# EAGLE design mic4606_logic (EAGLE 6.4)
Logic board for the Brushed Controller (v2a)

## Sheet 1 of 5
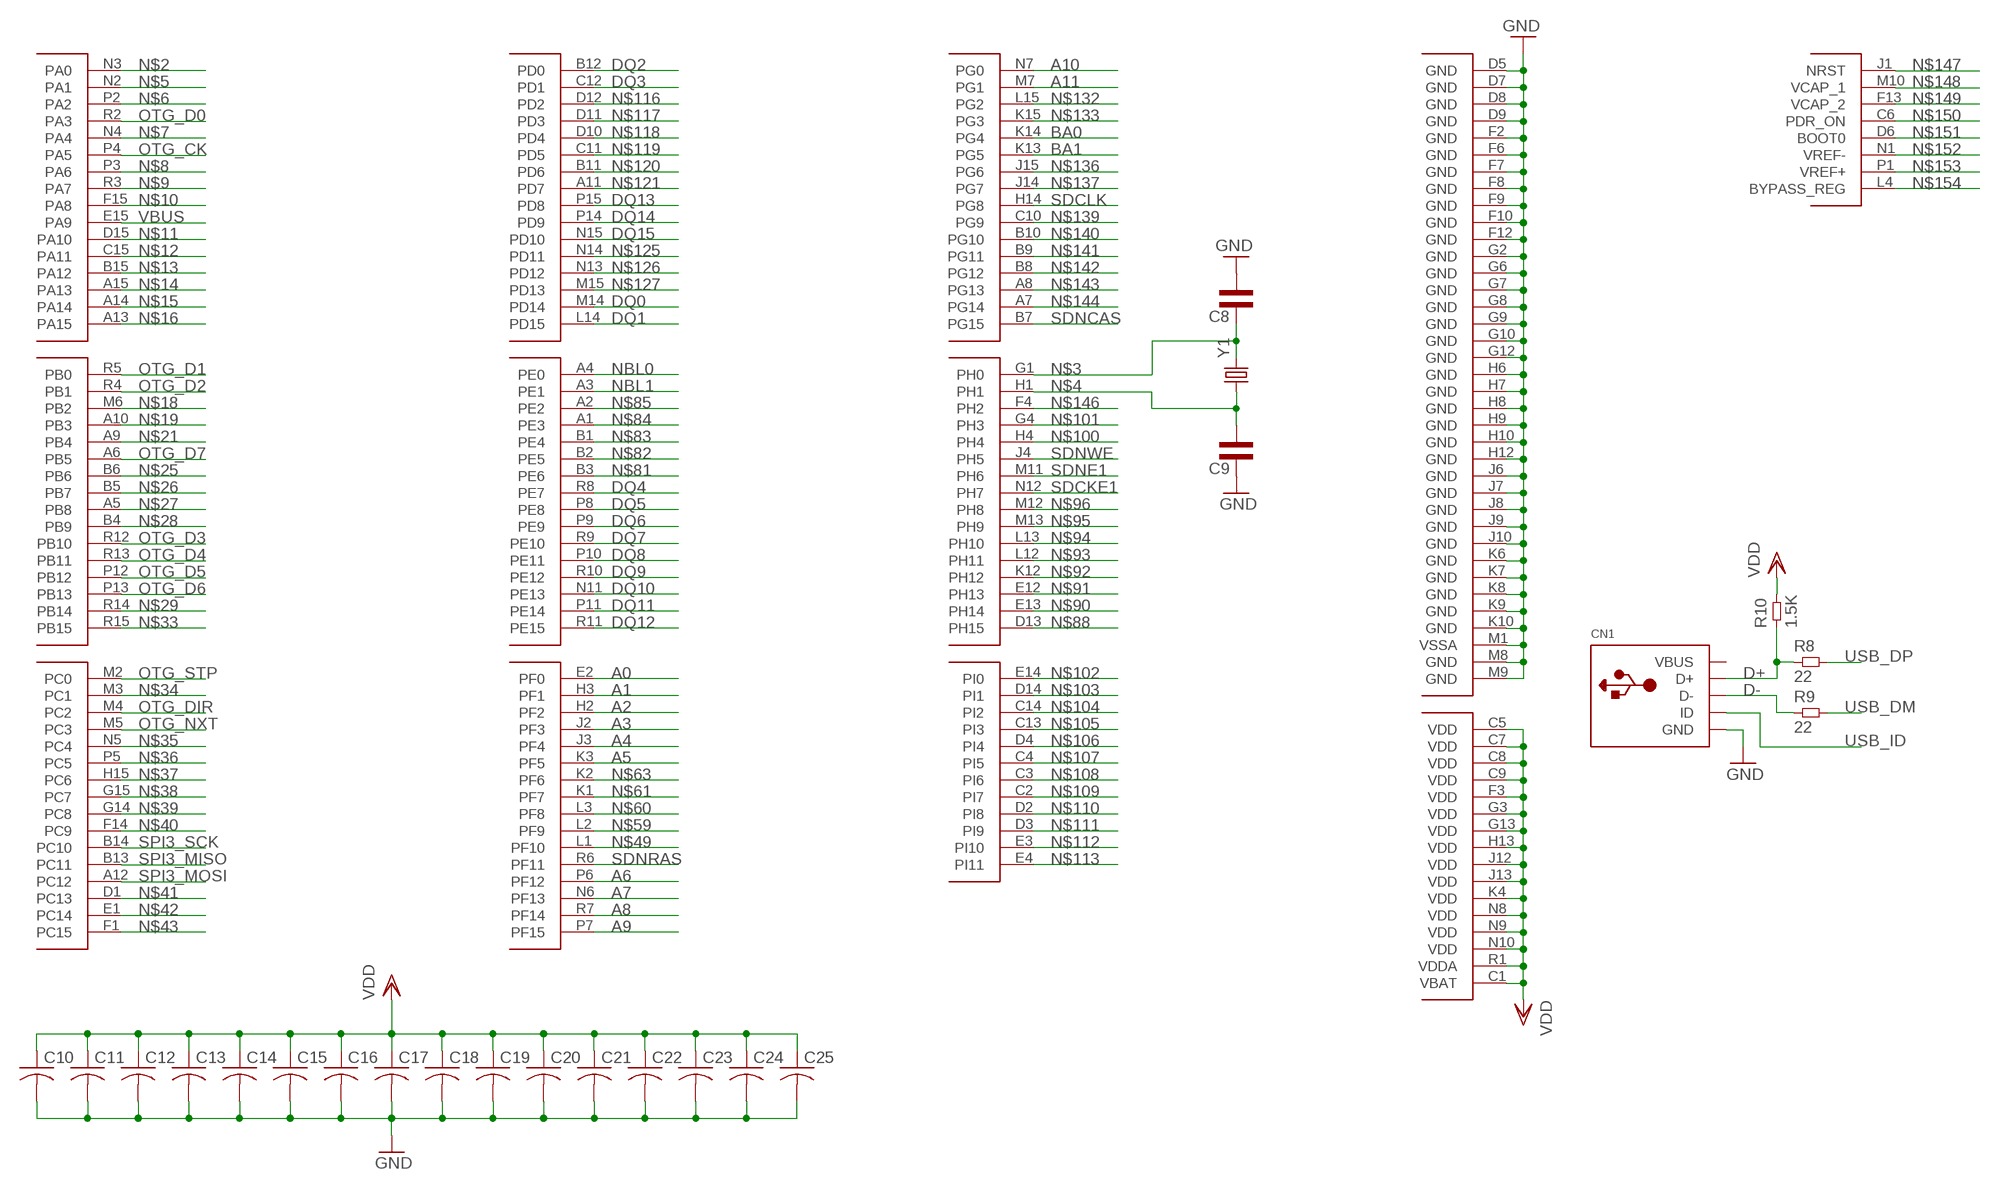
[diagram p0: schematic, sheet 1]

### Parts
C8  CAP0603L3  [0603L3]
C9  CAP0603L3  [0603L3]
C10  C-USC0201  [C0201]
C11  C-USC0201  [C0201]
C12  C-USC0201  [C0201]
C13  C-USC0201  [C0201]
C14  C-USC0201  [C0201]
C15  C-USC0201  [C0201]
C16  C-USC0201  [C0201]
C17  C-USC0201  [C0201]
C18  C-USC0201  [C0201]
C19  C-USC0201  [C0201]
C20  C-USC0201  [C0201]
C21  C-USC0201  [C0201]
C22  C-USC0201  [C0201]
C23  C-USC0201  [C0201]
C24  C-USC0201  [C0201]
C25  C-USC0201  [C0201]
CN1  USBMINIB  [USB-MINIB]
R8  22  RES0402L3  [0402L3]
R9  22  RES0402L3  [0402L3]
R10  1.5K  RES0402L3  [0402L3]
U$3  STM32_32BIT_MCU_STM32F407IG  [STM32_32BIT_MCU_UFBGA176+25]
Y1  CRYSTALHC49US  [HC49US]

### Nets
A0 [SDRAM]: U$3.E2(PF0) ; also sheet 3
A1 [SDRAM]: U$3.H3(PF1) ; also sheet 3
A2 [SDRAM]: U$3.H2(PF2) ; also sheet 3
A3 [SDRAM]: U$3.J2(PF3) ; also sheet 3
A4 [SDRAM]: U$3.J3(PF4) ; also sheet 3
A5 [SDRAM]: U$3.K3(PF5) ; also sheet 3
A6 [SDRAM]: U$3.P6(PF12) ; also sheet 3
A7 [SDRAM]: U$3.N6(PF13) ; also sheet 3
A8 [SDRAM]: U$3.R7(PF14) ; also sheet 3
A9 [SDRAM]: U$3.P7(PF15) ; also sheet 3
A10 [SDRAM]: U$3.N7(PG0) ; also sheet 3
A11 [SDRAM]: U$3.M7(PG1) ; also sheet 3
BA0 [SDRAM]: U$3.K14(PG4) ; also sheet 3
BA1 [SDRAM]: U$3.K13(PG5) ; also sheet 3
D+: CN1.D+ R8.P$1 R10.P$1
D-: CN1.D- R9.P$1
DQ0 [SDRAM]: U$3.M14(PD14) ; also sheet 3
DQ1 [SDRAM]: U$3.L14(PD15) ; also sheet 3
DQ2 [SDRAM]: U$3.B12(PD0) ; also sheet 3
DQ3 [SDRAM]: U$3.C12(PD1) ; also sheet 3
DQ4 [SDRAM]: U$3.R8(PE7) ; also sheet 3
DQ5 [SDRAM]: U$3.P8(PE8) ; also sheet 3
DQ6 [SDRAM]: U$3.P9(PE9) ; also sheet 3
DQ7 [SDRAM]: U$3.R9(PE10) ; also sheet 3
DQ8 [SDRAM]: U$3.P10(PE11) ; also sheet 3
DQ9 [SDRAM]: U$3.R10(PE12) ; also sheet 3
DQ10 [SDRAM]: U$3.N11(PE13) ; also sheet 3
DQ11 [SDRAM]: U$3.P11(PE14) ; also sheet 3
DQ12 [SDRAM]: U$3.R11(PE15) ; also sheet 3
DQ13 [SDRAM]: U$3.P15(PD8) ; also sheet 3
DQ14 [SDRAM]: U$3.P14(PD9) ; also sheet 3
DQ15 [SDRAM]: U$3.N15(PD10) ; also sheet 3
GND [PWR]: C8.P$2 C9.P$1 C10.2 C11.2 C12.2 C13.2 C14.2 C15.2 C16.2 C17.2 C18.2 C19.2 C20.2 C21.2 C22.2 C23.2 C24.2 C25.2 CN1.GND U$3.D5(GND) U$3.D7(GND) U$3.D8(GND) U$3.D9(GND) U$3.F2(GND) U$3.F6(GND) U$3.F7(GND) U$3.F8(GND) U$3.F9(GND) U$3.F10(GND) U$3.F12(GND) U$3.G2(GND) U$3.G6(GND) U$3.G7(GND) U$3.G8(GND) U$3.G9(GND) U$3.G10(GND) U$3.G12(GND) U$3.H6(GND) U$3.H7(GND) U$3.H8(GND) U$3.H9(GND) U$3.H10(GND) U$3.H12(GND) U$3.J6(GND) U$3.J7(GND) U$3.J8(GND) U$3.J9(GND) U$3.J10(GND) U$3.K6(GND) U$3.K7(GND) U$3.K8(GND) U$3.K9(GND) U$3.K10(GND) U$3.M1(VSSA) U$3.M8(GND) U$3.M9(GND) ; also sheet 2,3
N$2: U$3.N3(PA0)
N$3: C8.P$1 U$3.G1(PH0) Y1.2
N$4: C9.P$2 U$3.H1 Y1.1
N$5: U$3.N2(PA1)
N$6: U$3.P2(PA2)
N$7: U$3.N4(PA4)
N$8: U$3.P3(PA6)
N$9: U$3.R3(PA7)
N$10: U$3.F15(PA8)
N$11: U$3.D15(PA10)
N$12: U$3.C15(PA11)
N$13: U$3.B15(PA12)
N$14: U$3.A15(PA13)
N$15: U$3.A14
N$16: U$3.A13(PA15)
N$18: U$3.M6(PB2)
N$19: U$3.A10(PB3)
N$21: U$3.A9(PB4)
N$25: U$3.B6
N$26: U$3.B5(PB7)
N$27: U$3.A5(PB8)
N$28: U$3.B4(PB9)
N$29: U$3.R14(PB14)
N$33: U$3.R15(PB15)
N$34: U$3.M3(PC1)
N$35: U$3.N5(PC4)
N$36: U$3.P5(PC5)
N$37: U$3.H15(PC6)
N$38: U$3.G15(PC7)
N$39: U$3.G14(PC8)
N$40: U$3.F14(PC9)
N$41: U$3.D1(PC13)
N$42: U$3.E1(PC14)
N$43: U$3.F1(PC15)
N$49: U$3.L1(PF10)
N$59: U$3.L2(PF9)
N$60: U$3.L3(PF8)
N$61: U$3.K1(PF7)
N$63: U$3.K2(PF6)
N$81: U$3.B3(PE6)
N$82: U$3.B2(PE5)
N$83: U$3.B1(PE4)
N$84: U$3.A1(PE3)
N$85: U$3.A2(PE2)
N$88: U$3.D13(PH15)
N$90: U$3.E13(PH14)
N$91: U$3.E12(PH13)
N$92: U$3.K12(PH12)
N$93: U$3.L12(PH11)
N$94: U$3.L13(PH10)
N$95: U$3.M13(PH9)
N$96: U$3.M12(PH8)
N$100: U$3.H4
N$101: U$3.G4(PH3)
N$102: U$3.E14(PI0)
N$103: U$3.D14(PI1)
N$104: U$3.C14(PI2)
N$105: U$3.C13(PI3)
N$106: U$3.D4(PI4)
N$107: U$3.C4(PI5)
N$108: U$3.C3(PI6)
N$109: U$3.C2(PI7)
N$110: U$3.D2(PI8)
N$111: U$3.D3(PI9)
N$112: U$3.E3(PI10)
N$113: U$3.E4(PI11)
N$116: U$3.D12(PD2)
N$117: U$3.D11(PD3)
N$118: U$3.D10(PD4)
N$119: U$3.C11(PD5)
N$120: U$3.B11(PD6)
N$121: U$3.A11(PD7)
N$125: U$3.N14(PD11)
N$126: U$3.N13(PD12)
N$127: U$3.M15(PD13)
N$132: U$3.L15(PG2)
N$133: U$3.K15(PG3)
N$136: U$3.J15(PG6)
N$137: U$3.J14(PG7)
N$139: U$3.C10(PG9)
N$140: U$3.B10(PG10)
N$141: U$3.B9(PG11)
N$142: U$3.B8(PG12)
N$143: U$3.A8(PG13)
N$144: U$3.A7(PG14)
N$146: U$3.F4(PH2)
N$147: U$3.J1(NRST)
N$148: U$3.M10(VCAP_1)
N$149: U$3.F13(VCAP_2)
N$150: U$3.C6(PDR_ON)
N$151: U$3.D6(BOOT0)
N$152: U$3.N1(VREF-)
N$153: U$3.P1(VREF+)
N$154: U$3.L4(BYPASS_REG)
NBL0: U$3.A4(PE0) ; also sheet 3
NBL1: U$3.A3(PE1) ; also sheet 3
OTG_CK: U$3.P4(PA5) ; also sheet 2
OTG_D0: U$3.R2(PA3) ; also sheet 2
OTG_D1: U$3.R5(PB0) ; also sheet 2
OTG_D2: U$3.R4(PB1) ; also sheet 2
OTG_D3: U$3.R12(PB10) ; also sheet 2
OTG_D4: U$3.R13(PB11) ; also sheet 2
OTG_D5: U$3.P12(PB12) ; also sheet 2
OTG_D6: U$3.P13(PB13) ; also sheet 2
OTG_D7: U$3.A6(PB5) ; also sheet 2
OTG_DIR: U$3.M4(PC2) ; also sheet 2
OTG_NXT: U$3.M5(PC3) ; also sheet 2
OTG_STP: U$3.M2(PC0) ; also sheet 2
SDCKE1 [SDRAM]: U$3.N12(PH7) ; also sheet 3
SDCLK [SDRAM]: U$3.H14(PG8) ; also sheet 3
SDNCAS [SDRAM]: U$3.B7(PG15) ; also sheet 3
SDNE1 [SDRAM]: U$3.M11(PH6) ; also sheet 3
SDNRAS [SDRAM]: U$3.R6(PF11) ; also sheet 3
SDNWE [SDRAM]: U$3.J4(PH5) ; also sheet 3
SPI3_MISO: U$3.B13(PC11) ; also sheet 5
SPI3_MOSI: U$3.A12(PC12) ; also sheet 5
SPI3_SCK: U$3.B14(PC10) ; also sheet 5
USB_DM: R9.P$2 ; also sheet 2
USB_DP: R8.P$2 ; also sheet 2
USB_ID: CN1.ID ; also sheet 2
VBUS: U$3.E15(PA9)
VDD [PWR]: C10.1 C11.1 C12.1 C13.1 C14.1 C15.1 C16.1 C17.1 C18.1 C19.1 C20.1 C21.1 C22.1 C23.1 C24.1 C25.1 R10.P$2 U$3.C1(VBAT) U$3.C5(VDD) U$3.C7(VDD) U$3.C8(VDD) U$3.C9(VDD) U$3.F3(VDD) U$3.G3(VDD) U$3.G13(VDD) U$3.H13(VDD) U$3.J12(VDD) U$3.J13(VDD) U$3.K4(VDD) U$3.N8(VDD) U$3.N9(VDD) U$3.N10(VDD) U$3.R1(VDDA) ; also sheet 2,3

## Sheet 2 of 5
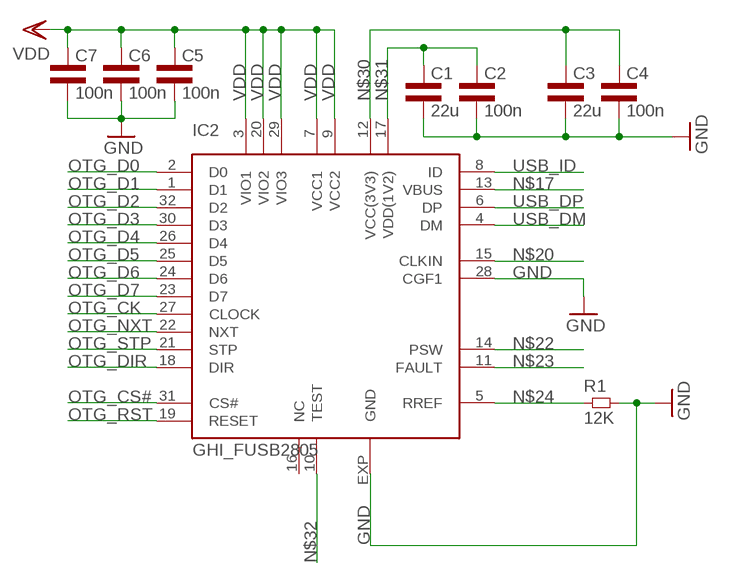
[diagram p1: schematic, sheet 2]

### Parts
C1  22u  CAP0805L3  [0805L3]
C2  100n  CAP0603L3  [0603L3]
C3  22u  CAP0805L3  [0805L3]
C4  100n  CAP0603L3  [0603L3]
C5  100n  CAP0603L3  [0603L3]
C6  100n  CAP0603L3  [0603L3]
C7  100n  CAP0603L3  [0603L3]
IC2  GHI_FUSB2805  [GHI_MLP32]
R1  12K  RES0402L3  [0402L3]

### Nets
GND [PWR]: C1.2 C2.P$2 C3.2 C4.P$2 C5.P$2 C6.P$2 C7.P$2 IC2.28(CGF1) IC2.EXP(GND) R1.P$2 ; also sheet 1,3
N$17: IC2.13(VBUS)
N$20: IC2.15(CLKIN)
N$22: IC2.14(PSW)
N$23: IC2.11(FAULT)
N$24: IC2.5(RREF) R1.P$1
N$30: C3.1 C4.P$1 IC2.12(VCC(3V3))
N$31: C1.1 C2.P$1 IC2.17(VDD(1V2))
N$32: IC2.10(TEST)
OTG_CK: IC2.27(CLOCK) ; also sheet 1
OTG_CS#: IC2.31(CS#)
OTG_D0: IC2.2(D0) ; also sheet 1
OTG_D1: IC2.1(D1) ; also sheet 1
OTG_D2: IC2.32(D2) ; also sheet 1
OTG_D3: IC2.30(D3) ; also sheet 1
OTG_D4: IC2.26(D4) ; also sheet 1
OTG_D5: IC2.25(D5) ; also sheet 1
OTG_D6: IC2.24(D6) ; also sheet 1
OTG_D7: IC2.23(D7) ; also sheet 1
OTG_DIR: IC2.18(DIR) ; also sheet 1
OTG_NXT: IC2.22(NXT) ; also sheet 1
OTG_RST: IC2.19(RESET)
OTG_STP: IC2.21(STP) ; also sheet 1
USB_DM: IC2.4(DM) ; also sheet 1
USB_DP: IC2.6(DP) ; also sheet 1
USB_ID: IC2.8(ID) ; also sheet 1
VDD [PWR]: C5.P$1 C6.P$1 C7.P$1 IC2.3(VIO1) IC2.7(VCC1) IC2.9(VCC2) IC2.20(VIO2) IC2.29(VIO3) ; also sheet 1,3
Unconnected: IC2.16(NC)

## Sheet 3 of 5
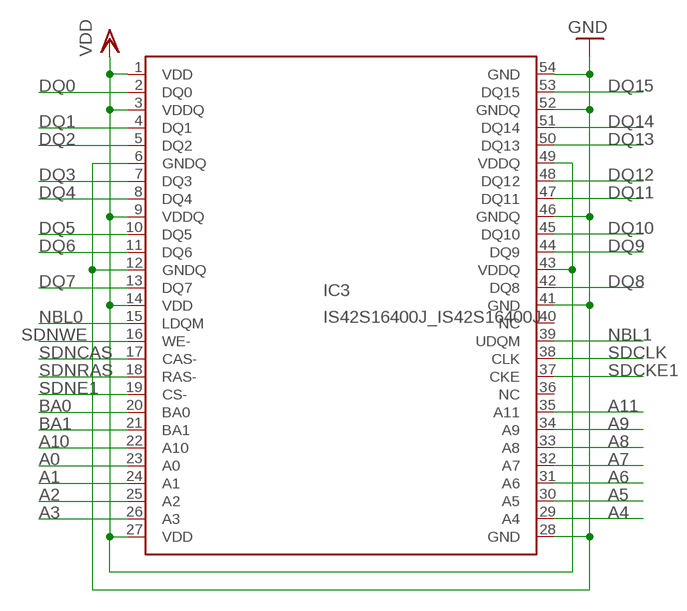
[diagram p2: schematic, sheet 3]

### Parts
IC3  IS42S16400J_IS42S16400J  [IS42S16400J_TSOP-2]

### Nets
A0 [SDRAM]: IC3.23(A0) ; also sheet 1
A1 [SDRAM]: IC3.24(A1) ; also sheet 1
A2 [SDRAM]: IC3.25(A2) ; also sheet 1
A3 [SDRAM]: IC3.26(A3) ; also sheet 1
A4 [SDRAM]: IC3.29(A4) ; also sheet 1
A5 [SDRAM]: IC3.30(A5) ; also sheet 1
A6 [SDRAM]: IC3.31(A6) ; also sheet 1
A7 [SDRAM]: IC3.32(A7) ; also sheet 1
A8 [SDRAM]: IC3.33(A8) ; also sheet 1
A9 [SDRAM]: IC3.34(A9) ; also sheet 1
A10 [SDRAM]: IC3.22(A10) ; also sheet 1
A11 [SDRAM]: IC3.35(A11) ; also sheet 1
BA0 [SDRAM]: IC3.20(BA0) ; also sheet 1
BA1 [SDRAM]: IC3.21(BA1) ; also sheet 1
DQ0 [SDRAM]: IC3.2(DQ0) ; also sheet 1
DQ1 [SDRAM]: IC3.4(DQ1) ; also sheet 1
DQ2 [SDRAM]: IC3.5(DQ2) ; also sheet 1
DQ3 [SDRAM]: IC3.7(DQ3) ; also sheet 1
DQ4 [SDRAM]: IC3.8(DQ4) ; also sheet 1
DQ5 [SDRAM]: IC3.10(DQ5) ; also sheet 1
DQ6 [SDRAM]: IC3.11(DQ6) ; also sheet 1
DQ7 [SDRAM]: IC3.13(DQ7) ; also sheet 1
DQ8 [SDRAM]: IC3.42(DQ8) ; also sheet 1
DQ9 [SDRAM]: IC3.44(DQ9) ; also sheet 1
DQ10 [SDRAM]: IC3.45(DQ10) ; also sheet 1
DQ11 [SDRAM]: IC3.47(DQ11) ; also sheet 1
DQ12 [SDRAM]: IC3.48(DQ12) ; also sheet 1
DQ13 [SDRAM]: IC3.50(DQ13) ; also sheet 1
DQ14 [SDRAM]: IC3.51(DQ14) ; also sheet 1
DQ15 [SDRAM]: IC3.53(DQ15) ; also sheet 1
GND [PWR]: IC3.6(GNDQ) IC3.12(GNDQ) IC3.28(GND) IC3.41(GND) IC3.46(GNDQ) IC3.52(GNDQ) IC3.54(GND) ; also sheet 1,2
NBL0: IC3.15(LDQM) ; also sheet 1
NBL1: IC3.39(UDQM) ; also sheet 1
SDCKE1 [SDRAM]: IC3.37(CKE) ; also sheet 1
SDCLK [SDRAM]: IC3.38(CLK) ; also sheet 1
SDNCAS [SDRAM]: IC3.17(CAS-) ; also sheet 1
SDNE1 [SDRAM]: IC3.19(CS-) ; also sheet 1
SDNRAS [SDRAM]: IC3.18(RAS-) ; also sheet 1
SDNWE [SDRAM]: IC3.16(WE-) ; also sheet 1
VDD [PWR]: IC3.1(VDD) IC3.3(VDDQ) IC3.9(VDDQ) IC3.14(VDD) IC3.27(VDD) IC3.43(VDDQ) IC3.49(VDDQ) ; also sheet 1,2
Unconnected: IC3.36(NC) IC3.40(NC)

## Sheet 4 of 5
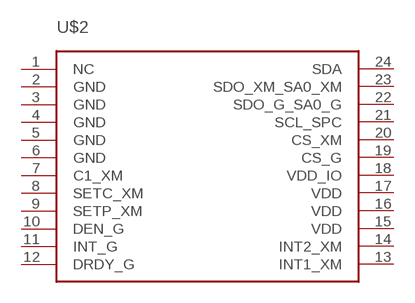
[diagram p3: schematic, sheet 4]

### Parts
U$2  ST_LSM9DS0_TEMP_SENSE_LSM9DS0  [ST_LSM9DS0_TEMP_SENSE_LGA-24]
Unconnected: U$2.1(NC) U$2.2(GND) U$2.3(GND) U$2.4(GND) U$2.5(GND) U$2.6(GND) U$2.7(C1_XM) U$2.8(SETC_XM) U$2.9(SETP_XM) U$2.10(DEN_G) U$2.11(INT_G) U$2.12(DRDY_G) U$2.13(INT1_XM) U$2.14(INT2_XM) U$2.15(VDD) U$2.16(VDD) U$2.17(VDD) U$2.18(VDD_IO) U$2.19(CS_G) U$2.20(CS_XM) U$2.21(SCL_SPC) U$2.22(SDO_G_SA0_G) U$2.23(SDO_XM_SA0_XM) U$2.24(SDA)

## Sheet 5 of 5
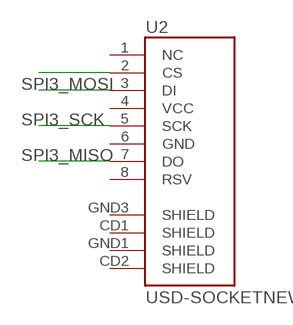
[diagram p4: schematic, sheet 5]

### Parts
U2  USD-SOCKETNEW  [MICRO-SD-SOCKET-PP]

### Nets
N$1: U2.2(CS)
SPI3_MISO: U2.7(DO) ; also sheet 1
SPI3_MOSI: U2.3(DI) ; also sheet 1
SPI3_SCK: U2.5(SCK) ; also sheet 1
Unconnected: U2.1(NC) U2.4(VCC) U2.6(GND) U2.8(RSV) U2.CD1(SHIELD) U2.CD2(SHIELD) U2.GND1(SHIELD) U2.GND3(SHIELD)

## Power pins joined to a net without a drawn wire
VBUS: CN1.VBUS

## Library data of the parts
C1-C9 = common:CAP
C10-C25 = rcl:C-US: CAPACITOR, American symbol
CN1 = adafruit:USB: USB Connectors USBMINIB - Surface Mount Female Mini-B USB Connector 4UConnector: 06564 By microbuilder.eu Thru-hole RA Female Mini-B USB Connector 4UConnector: 18732 By ladyada.net
IC2 = ALFAT_OEM_Board:GHI_FUSB2805
IC3 = Logic - Copy:IS42S16400J_IS42S16400J: edit this description Auto generated by make-symbol-device-package-bsdl.ulp Rev. 43 Source:
R1 R8-R10 = common:RES
U2 = SparkFun-Connectors:USD-SOCKET: microSD Socket Push-push type uSD socket. Schematic element and footprint production proven. Spark Fun Electronics SKU : PRT-00127. tDoc lines correctly indicate media card edge positions when inserting (unlocked, locked, depressed).
U$2 = logic_vB:ST_LSM9DS0_TEMP_SENSE_LSM9DS0: The LSM9DS0 is a gyro/accel/magnet sensor produced by ST.
U$3 = logic:STM32_32BIT_MCU_STM32F407IG
Y1 = SparkFun-FreqCtrl:CRYSTAL: Various standard crystals. Proven footprints. Spark Fun Electronics SKU : COM-00534

## Net classes
0 default: width 0.254 mm, drill 0.33 mm, clearance 0.254 mm
1 PWR: width 0.61 mm, drill 0.33 mm, clearance 0.254 mm
2 SDRAM: width 0.127 mm, drill 0.254 mm, clearance 0.127 mm

## Board
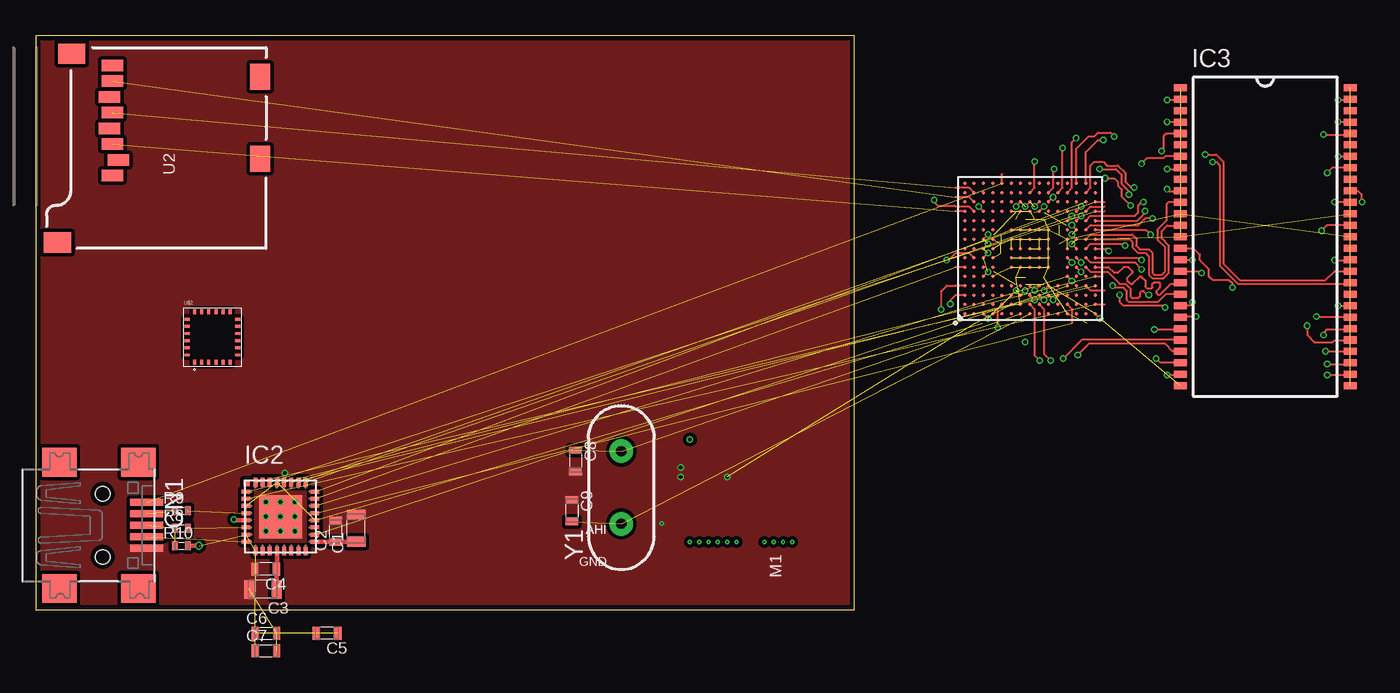
[diagram p5: board, top side]
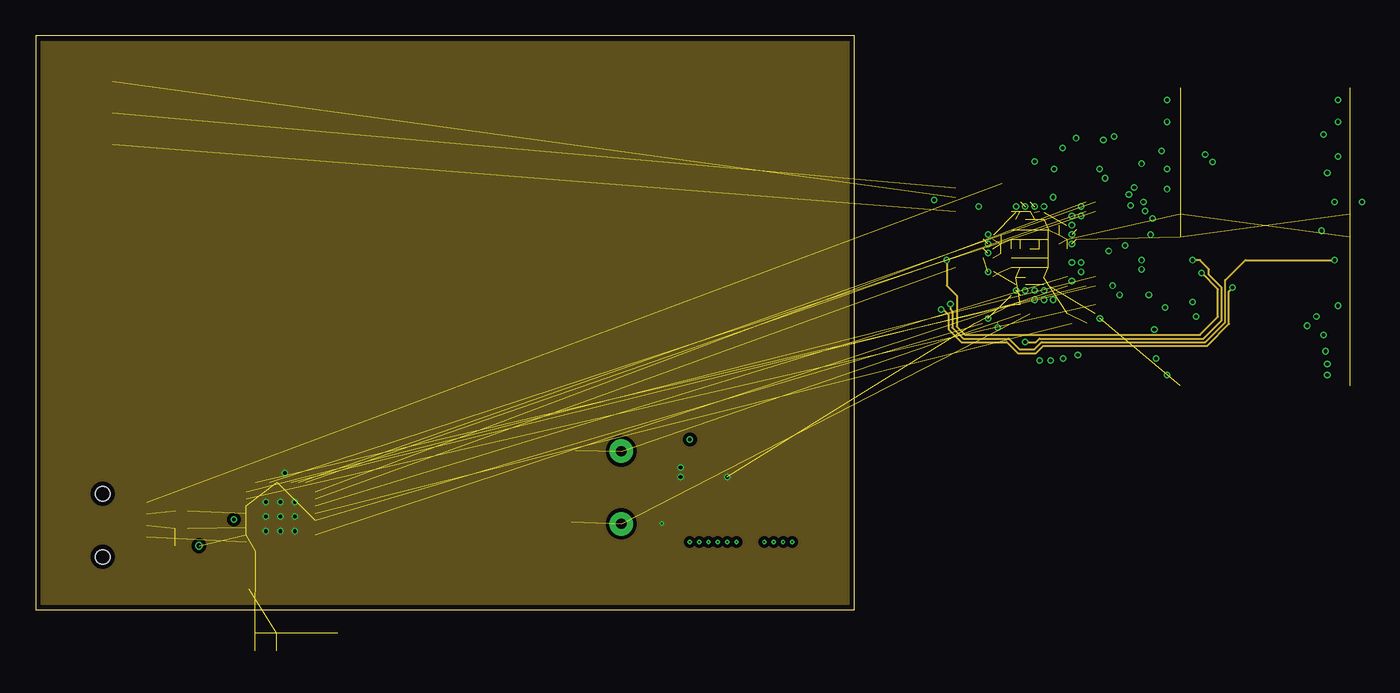
[diagram p6: board, inner layer Route2]
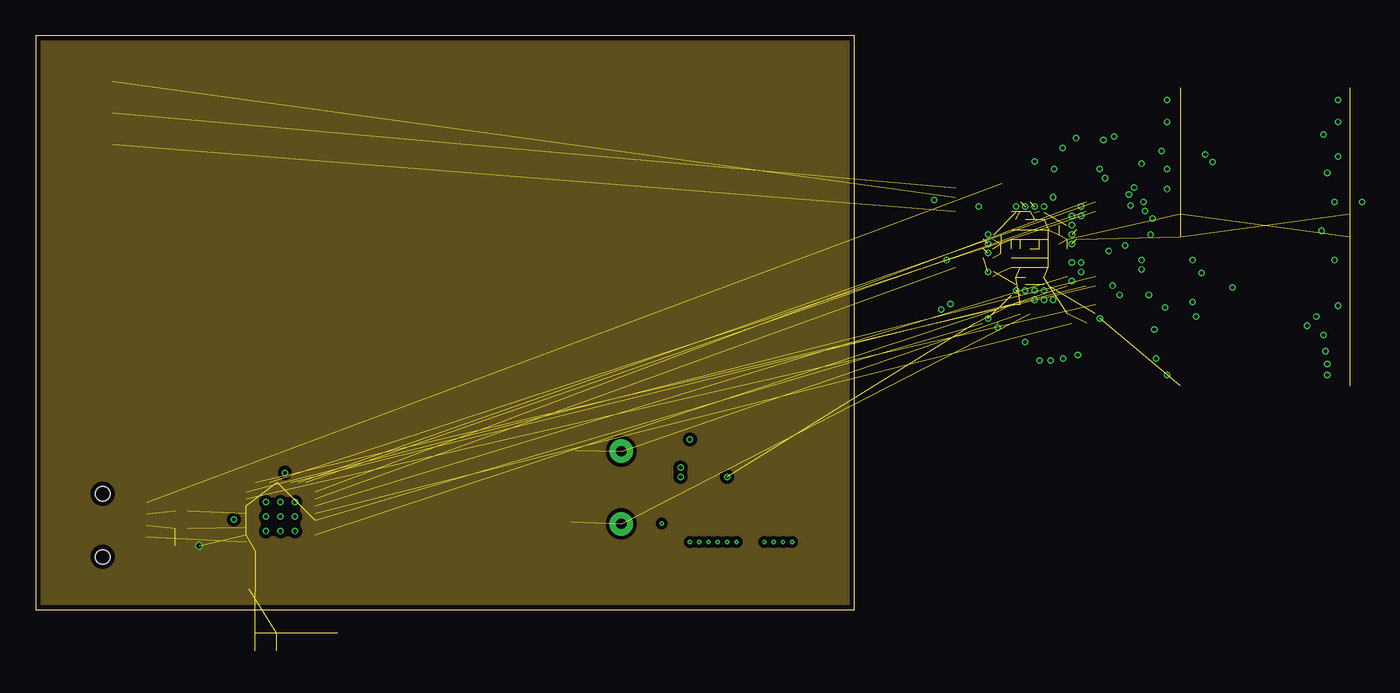
[diagram p7: board, inner layer Route3]
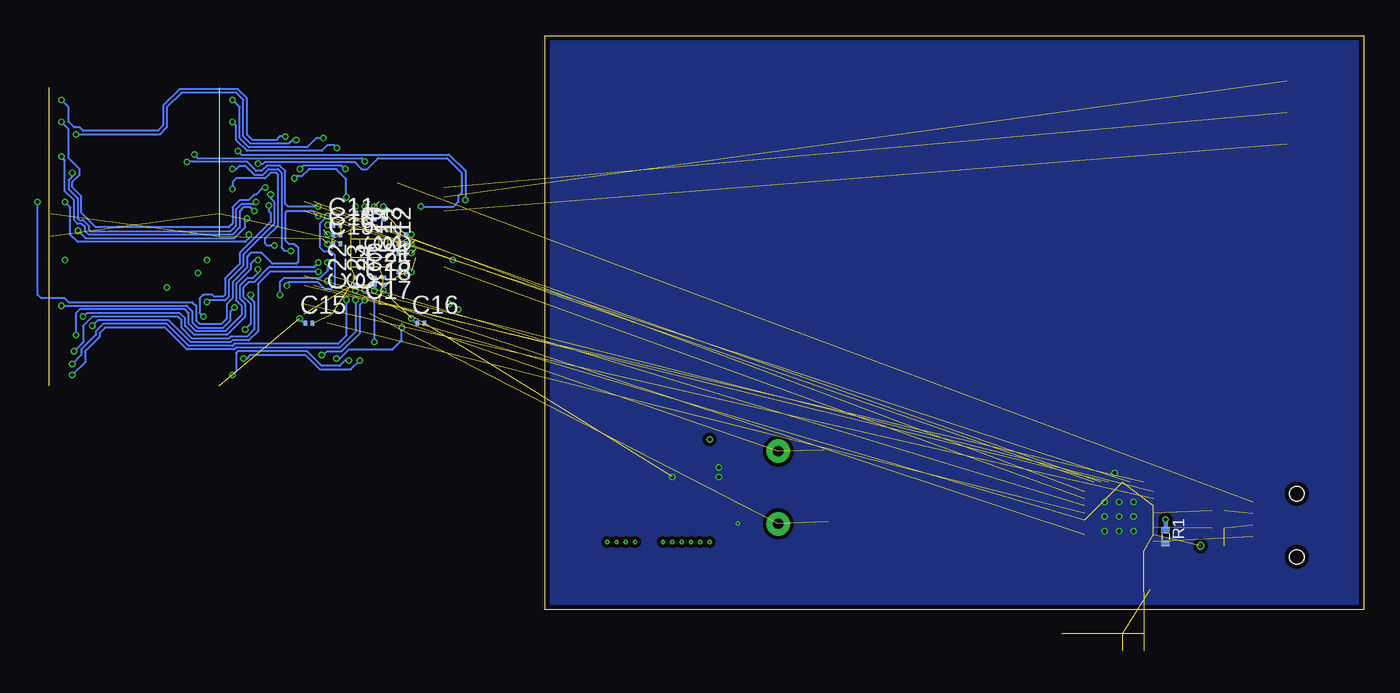
[diagram p8: board, bottom side, seen from below]

Size 57.1 x 40.03 mm. Coordinates in mm from the lower left corner, seen from the top.
Outline: 57.1,0 57.1,40.03 0,40.03 0,0 57.1,0
Copper layers (1*2*3*16): Top 0.035mm / dielectric 1.5mm / Route2 0.035mm / dielectric 0.15mm / Route3 0.035mm / dielectric 0.2mm / Bottom 0.035mm
Design rules "default *": minimum track width 5mil, minimum drill 10mil, track to track 5mil, track to pad 5mil, pad to pad 5mil, via to via 5mil, smd to smd 5mil, copper to edge 13mil, drill to drill 5mil, minimum pad ring 4mil, minimum via ring 4mil, stop-mask expansion 4mil, vias tented up to drill 13mil, thermal gap 10mil

### Footprints (pad centres in the part's own frame; a part is rotated, then mirrored left to right if it is on the bottom)
0805L3 = smd 0.7 x 1.3: 1 -0.95,0; 2 0.95,0
0603L3 = smd 0.5 x 0.9: P$1 -0.75,0; P$2 0.75,0
C0201 = smd 0.25 x 0.35: 1 -0.25,0; 2 0.25,0
USB-MINIB = smd 0.5 x 2.308: D+ 0,4.064; D- -0.8,4.064; GND 1.6,4.064; ID 0.8,4.064; VBUS -1.6,4.064 | smd 2 x 2.4: GND1 -4.4,-2; GND2 -4.4,3.5; GND3 4.4,3.5; GND4 4.4,-2 | hole 1: -2.2,1; 2.2,1
GHI_MLP32 = smd 0.6 x 0.28: 1 -2.4,1.75; 2 -2.4,1.25; 3 -2.4,0.75; 4 -2.4,0.25; 5 -2.4,-0.25; 6 -2.4,-0.75; 7 -2.4,-1.25; 8 -2.4,-1.75; 17 2.4,-1.75; 18 2.4,-1.25; 19 2.4,-0.75; 20 2.4,-0.25; 21 2.4,0.25; 22 2.4,0.75; 23 2.4,1.25; 24 2.4,1.75 | smd 0.28 x 0.6: 9 -1.75,-2.4; 10 -1.25,-2.4; 11 -0.75,-2.4; 12 -0.25,-2.4; 13 0.25,-2.4; 14 0.75,-2.4; 15 1.25,-2.4; 16 1.75,-2.4; 25 1.75,2.4; 26 1.25,2.4; 27 0.75,2.4; 28 0.25,2.4; 29 -0.25,2.4; 30 -0.75,2.4; 31 -1.25,2.4; 32 -1.75,2.4 | smd 3 x 3: EXP 0,0 | smd 0.435 x 0.435: M -2.353,2.353
IS42S16400J_TSOP-2 = smd 0.9 x 0.49: 1 -5.93,10.4; 2 -5.93,9.6; 3 -5.93,8.8; 4 -5.93,8; 5 -5.93,7.2; 6 -5.93,6.4; 7 -5.93,5.6; 8 -5.93,4.8; 9 -5.93,4; 10 -5.93,3.2; 11 -5.93,2.4; 12 -5.93,1.6; 13 -5.93,0.8; 14 -5.93,0; 15 -5.93,-0.8; 16 -5.93,-1.6; 17 -5.93,-2.4; 18 -5.93,-3.2; 19 -5.93,-4; 20 -5.93,-4.8; 21 -5.93,-5.6; 22 -5.93,-6.4; 23 -5.93,-7.2; 24 -5.93,-8; 25 -5.93,-8.8; 26 -5.93,-9.6; 27 -5.93,-10.4; 28 5.93,-10.4; 29 5.93,-9.6; 30 5.93,-8.8; 31 5.93,-8; 32 5.93,-7.2; 33 5.93,-6.4; 34 5.93,-5.6; 35 5.93,-4.8; 36 5.93,-4; 37 5.93,-3.2; 38 5.93,-2.4; 39 5.93,-1.6; 40 5.93,-0.8; 41 5.93,0; 42 5.93,0.8; 43 5.93,1.6; 44 5.93,2.4; 45 5.93,3.2; 46 5.93,4; 47 5.93,4.8; 48 5.93,5.6; 49 5.93,6.4; 50 5.93,7.2; 51 5.93,8; 52 5.93,8.8; 53 5.93,9.6; 54 5.93,10.4
0402L3 = smd 0.4 x 0.6: P$1 -0.45,0; P$2 0.45,0
MICRO-SD-SOCKET-PP = smd 0.8 x 1.5: 1 -8.94,10.7; 2 -7.84,10.3; 3 -6.74,10.7; 4 -5.64,10.9; 5 -4.54,10.7; 6 -3.44,10.9; 7 -2.34,10.7; 8 -1.24,10.7 | smd 1.8 x 1.4: CD1 -2.05,0.4; CD2 -7.75,0.4 | smd 1.4 x 1.9: GND1 -13.6,14.55; GND3 -0.45,13.55
ST_LSM9DS0_TEMP_SENSE_LGA-24 = smd 0.2 x 0.35: 1 -1.25,-1.75; 2 -0.75,-1.75; 3 -0.25,-1.75; 4 0.25,-1.75; 5 0.75,-1.75; 6 1.25,-1.75; 13 1.25,1.75; 14 0.75,1.75; 15 0.25,1.75; 16 -0.25,1.75; 17 -0.75,1.75; 18 -1.25,1.75 | smd 0.35 x 0.2: 7 1.75,-1.25; 8 1.75,-0.75; 9 1.75,-0.25; 10 1.75,0.25; 11 1.75,0.75; 12 1.75,1.25; 19 -1.75,1.25; 20 -1.75,0.75; 21 -1.75,0.25; 22 -1.75,-0.25; 23 -1.75,-0.75; 24 -1.75,-1.25
STM32_32BIT_MCU_UFBGA176+25 = smd 0.23 x 0.23: A1 -4.55,4.55; A2 -3.9,4.55; A3 -3.25,4.55; A4 -2.6,4.55; A5 -1.95,4.55; A6 -1.3,4.55; A7 -0.65,4.55; A8 0,4.55; A9 0.65,4.55; A10 1.3,4.55; A11 1.95,4.55; A12 2.6,4.55; A13 3.25,4.55; A14 3.9,4.55; A15 4.55,4.55; B1 -4.55,3.9; B2 -3.9,3.9; B3 -3.25,3.9; B4 -2.6,3.9; B5 -1.95,3.9; B6 -1.3,3.9; B7 -0.65,3.9; B8 0,3.9; B9 0.65,3.9; B10 1.3,3.9; B11 1.95,3.9; B12 2.6,3.9; B13 3.25,3.9; B14 3.9,3.9; B15 4.55,3.9; C1 -4.55,3.25; C2 -3.9,3.25; C3 -3.25,3.25; C4 -2.6,3.25; C5 -1.95,3.25; C6 -1.3,3.25; C7 -0.65,3.25; C8 0,3.25; C9 0.65,3.25; C10 1.3,3.25; C11 1.95,3.25; C12 2.6,3.25; C13 3.25,3.25; C14 3.9,3.25; C15 4.55,3.25; D1 -4.55,2.6; D2 -3.9,2.6; D3 -3.25,2.6; D4 -2.6,2.6; D5 -1.95,2.6; D6 -1.3,2.6; D7 -0.65,2.6; D8 0,2.6; D9 0.65,2.6; D10 1.3,2.6; D11 1.95,2.6; D12 2.6,2.6; D13 3.25,2.6; D14 3.9,2.6; D15 4.55,2.6; E1 -4.55,1.95; E2 -3.9,1.95; E3 -3.25,1.95; E4 -2.6,1.95; E12 2.6,1.95; E13 3.25,1.95; E14 3.9,1.95; E15 4.55,1.95; F1 -4.55,1.3; F2 -3.9,1.3; F3 -3.25,1.3; F4 -2.6,1.3; F6 -1.3,1.3; F7 -0.65,1.3; F8 0,1.3; F9 0.65,1.3; F10 1.3,1.3; F12 2.6,1.3; F13 3.25,1.3; F14 3.9,1.3; F15 4.55,1.3; G1 -4.55,0.65; G2 -3.9,0.65; G3 -3.25,0.65; G4 -2.6,0.65; G6 -1.3,0.65; G7 -0.65,0.65; G8 0,0.65; G9 0.65,0.65; G10 1.3,0.65; G12 2.6,0.65; G13 3.25,0.65; G14 3.9,0.65; G15 4.55,0.65; H1 -4.55,0; H2 -3.9,0; H3 -3.25,0; H4 -2.6,0; H6 -1.3,0; H7 -0.65,0; H8 0,0; H9 0.65,0; H10 1.3,0; H12 2.6,0; H13 3.25,0; H14 3.9,0; H15 4.55,0; J1 -4.55,-0.65; J2 -3.9,-0.65; J3 -3.25,-0.65; J4 -2.6,-0.65; J6 -1.3,-0.65; J7 -0.65,-0.65; J8 0,-0.65; J9 0.65,-0.65; J10 1.3,-0.65; J12 2.6,-0.65; J13 3.25,-0.65; J14 3.9,-0.65; J15 4.55,-0.65; K1 -4.55,-1.3; K2 -3.9,-1.3; K3 -3.25,-1.3; K4 -2.6,-1.3; K6 -1.3,-1.3; K7 -0.65,-1.3; K8 0,-1.3; K9 0.65,-1.3; K10 1.3,-1.3; K12 2.6,-1.3; K13 3.25,-1.3; K14 3.9,-1.3; K15 4.55,-1.3; L1 -4.55,-1.95; L2 -3.9,-1.95; L3 -3.25,-1.95; L4 -2.6,-1.95; L12 2.6,-1.95; L13 3.25,-1.95; L14 3.9,-1.95; L15 4.55,-1.95; M1 -4.55,-2.6; M2 -3.9,-2.6; M3 -3.25,-2.6; M4 -2.6,-2.6; M5 -1.95,-2.6; M6 -1.3,-2.6; M7 -0.65,-2.6; M8 0,-2.6; M9 0.65,-2.6; M10 1.3,-2.6; M11 1.95,-2.6; M12 2.6,-2.6; M13 3.25,-2.6; M14 3.9,-2.6; M15 4.55,-2.6; N1 -4.55,-3.25; N2 -3.9,-3.25; N3 -3.25,-3.25; N4 -2.6,-3.25; N5 -1.95,-3.25; N6 -1.3,-3.25; N7 -0.65,-3.25; N8 0,-3.25; N9 0.65,-3.25; N10 1.3,-3.25; N11 1.95,-3.25; N12 2.6,-3.25; N13 3.25,-3.25; N14 3.9,-3.25; N15 4.55,-3.25; P1 -4.55,-3.9; P2 -3.9,-3.9; P3 -3.25,-3.9; P4 -2.6,-3.9; P5 -1.95,-3.9; P6 -1.3,-3.9; P7 -0.65,-3.9; P8 0,-3.9; P9 0.65,-3.9; P10 1.3,-3.9; P11 1.95,-3.9; P12 2.6,-3.9; P13 3.25,-3.9; P14 3.9,-3.9; P15 4.55,-3.9; R1 -4.55,-4.55; R2 -3.9,-4.55; R3 -3.25,-4.55; R4 -2.6,-4.55; R5 -1.95,-4.55; R6 -1.3,-4.55; R7 -0.65,-4.55; R8 0,-4.55; R9 0.65,-4.55; R10 1.3,-4.55; R11 1.95,-4.55; R12 2.6,-4.55; R13 3.25,-4.55; R14 3.9,-4.55; R15 4.55,-4.55
HC49US = drill 0.7 pad 1.651: 1 -2.54,0; 2 2.54,0

### Placement (x,y rotation side)
C1  22.35,5.69 90 top
C2  20.93,5.49 90 top
C3  15.85,1.42 180 top
C4  16.05,2.84 180 top
C5  20.32,-1.63 180 top
C6  16.05,-1.63 0 top
C7  16.05,-2.84 0 top
C8  37.64,10.39 270 top
C9  37.39,6.91 270 top
C10  71.63,26.17 0 bottom  (outside the outline)
C11  71.63,26.83 0 bottom  (outside the outline)
C12  68.38,27.47 270 bottom  (outside the outline)
C13  69.03,27.47 270 bottom  (outside the outline)
C14  69.68,27.47 270 bottom  (outside the outline)
C15  73.58,20 0 bottom  (outside the outline)
C16  65.78,20 0 bottom  (outside the outline)
C17  67.08,23.58 180 bottom  (outside the outline)
C18  67.08,24.88 180 bottom  (outside the outline)
C19  71.63,25.52 0 bottom  (outside the outline)
C20  70.33,27.47 270 bottom  (outside the outline)
C21  67.08,26.17 180 bottom  (outside the outline)
C22  70.33,22.92 90 bottom  (outside the outline)
C23  69.03,22.92 90 bottom  (outside the outline)
C24  68.38,22.92 90 bottom  (outside the outline)
C25  67.08,25.52 180 bottom  (outside the outline)
CN1  3.66,5.89 270 top
IC2  17.07,6.5 0 top
IC3  85.76,26.02 0 top  (outside the outline)
R1  13.82,5.08 270 bottom
R8  10.16,5.69 0 top
R9  10.16,6.91 0 top
R10  10.16,4.47 0 top
U2  16.05,39.22 90 top
U$2  12.32,19.02 0 top
U$3  69.35,25.2 90 top  (outside the outline)
Y1  40.84,8.53 90 top

### Tracks (layer width: path | path; a pad name or v marks a point on that pad's centre or on a via)
A0  (via drill 0.25)  (1 unrouted)
  Top 0.127: U$3.E2 67.08,20.97 67.08,20 | 67.11,19.97 v67.11,19.69 | IC3.23 72.97,18.82 v71.68,17.53
  Bottom 0.127: v67.11,19.69 67.11,18.8 67.74,18.16 70.79,18.16 71.42,17.53 v71.68,17.53
A1  (via drill 0.25)
  Top 0.127: U$3.H3 v69.68,21.62 | IC3.24 79.84,18.03 79.3,18.03 78.79,18.54 73.46,18.54 v72.69,17.78
  Bottom 0.127: v72.69,17.78 72.57,17.78 72.31,18.03 71.3,18.03 70.03,19.3 70.03,21.27 v69.68,21.62
A2  (via drill 0.25)
  Top 0.127: U$3.H2 69.68,20.97 69.68,17.75 v70.03,17.4 | v78.16,17.53 78.41,17.27 79.78,17.27 IC3.25
  Bottom 0.127: v78.16,17.53 77.9,17.53 77.65,17.78 73.84,17.78 72.82,16.76 70.66,16.76 v70.03,17.4
A3  (via drill 0.25)
  Top 0.127: U$3.J2 70.33,20.97 70.33,17.86 v70.79,17.4 | 79.87,16.38 IC3.26 79.79,16.38 v78.92,16.38
  Bottom 0.127: v70.79,17.4 71.04,17.4 71.42,17.02 72.69,17.02 73.71,18.03 78.54,18.03 78.66,17.91 78.66,16.64 v78.92,16.38
A4  (via drill 0.25)
  Top 0.127: U$3.J3 v70.33,21.62 | v90.09,16.38 91.65,16.38 IC3.29
  Bottom 0.127: v70.33,21.62 70.33,19.38 71.42,18.29 78.66,18.29 78.79,18.16 82.09,18.16 83.62,19.69 87.81,19.69 88.19,19.3 88.19,19.05 89.2,18.03 89.2,17.27 v90.09,16.38
A5  (via drill 0.25)
  Top 0.127: U$3.K3 v70.98,21.62 | v90.09,17.14 91.62,17.14 IC3.30
  Bottom 0.127: v70.98,21.62 70.98,19.12 71.55,18.54 78.79,18.54 78.92,18.41 81.97,18.41 83.49,19.94 87.93,19.94 88.44,19.43 88.44,19.18 89.46,18.16 89.46,17.78 v90.09,17.14
A6  (via drill 0.25)
  Top 0.127: U$3.P6 73.58,23.58 74.77,23.58 75.62,22.73 76,22.73 76.38,22.35 76.38,21.84 76.5,21.72 76.89,21.72 77.01,21.84 77.01,22.1 77.14,22.22 77.27,22.22 77.52,21.97 v77.65,21.97 | v89.97,18.03 91.68,18.03 IC3.31
  Bottom 0.127: v89.97,18.03 89.33,18.67 89.33,19.81 88.7,20.45 82.73,20.45 82.47,20.19 82.47,19.69 81.71,18.92 79.17,18.92 79.04,19.05 77.9,19.05 77.39,19.56 77.39,21.46 77.65,21.72 v77.65,21.97
A7  (via drill 0.25)
  Top 0.127: U$3.N6 v72.93,23.58 | v88.7,19.81 88.7,19.18 89.2,18.67 90.47,18.67 90.6,18.8 91.67,18.8 IC3.32
  Bottom 0.127: v72.93,23.58 76.3,23.58 77.14,22.73 77.14,19.43 77.77,18.8 78.92,18.8 79.04,18.67 81.84,18.67 83.36,20.19 88.32,20.19 v88.7,19.81
A8  (via drill 0.25)
  Top 0.127: U$3.R7 76.97,24.55 v77.14,24.38 | v89.84,19.18 89.84,19.3 90.09,19.56 91.63,19.56 IC3.33
  Bottom 0.127: v77.14,24.38 77.39,24.38 77.65,24.13 77.65,23.75 78.66,22.73 78.66,21.59 78.28,21.21 78.28,20.57 79.43,19.43 81.46,19.43 81.97,19.94 81.97,20.7 82.22,20.95 89.59,20.95 89.84,20.7 v89.84,19.18
A9  (via drill 0.25)
  Top 0.127: U$3.P7 73.58,24.22 76.66,24.22 v77.14,23.75 | v89.33,20.45 91.66,20.45 IC3.34
  Bottom 0.127: v77.14,23.75 77.14,23.49 77.52,23.11 77.9,23.11 78.41,22.61 78.41,21.72 78.03,21.34 78.03,20.45 79.3,19.18 81.58,19.18 82.22,19.81 82.22,20.32 82.6,20.7 89.08,20.7 v89.33,20.45
A10  (via drill 0.25)
  Top 0.127: U$3.N7 v72.93,24.22 | v78.03,19.56 79.77,19.56 IC3.22
  Bottom 0.127: v78.03,19.56 77.65,19.94 77.65,21.34 78.16,21.84 78.16,22.48 77.77,22.86 77.39,22.86 76.38,23.88 73.2,23.88 72.93,24.15 v72.93,24.22
A11  (via drill 0.25)
  Top 0.127: U$3.M7 v72.28,24.22 | v78.79,21.08 78.66,21.21 75.87,21.21 75.62,21.46 v75.62,21.97 | v90.86,21.21 91.68,21.21 IC3.35
  Bottom 0.127: v72.28,24.22 72.28,23.66 72.82,23.11 75.36,23.11 75.62,22.86 v75.62,21.97 | v90.86,21.21 82.09,21.21 81.71,20.83 81.71,20.07 81.33,19.69 79.55,19.69 79.04,20.19 79.04,20.83 v78.79,21.08
BA0  (via drill 0.25)
  Top 0.127: U$3.K14 70.98,29.42 70.98,30.67 v71.04,30.73 | v74.22,30.73 75.36,30.73 75.74,30.35 75.74,29.72 76.25,29.21 v76.25,28.96 | v80.7,21.46 80.7,21.34 80.57,21.21 IC3.20
  Bottom 0.127: v71.04,30.73 71.3,30.99 73.96,30.99 v74.22,30.73 | v76.25,28.96 76.25,28.7 76,28.45 76,26.92 78.16,24.77 78.16,24 79.17,22.99 79.17,21.84 79.43,21.59 80.57,21.59 v80.7,21.46
BA1  (via drill 0.25)
  Top 0.127: U$3.K13 v70.98,28.77 | v74.6,30.1 75.23,30.1 75.49,29.84 75.49,29.59 75.74,29.34 75.74,28.83 v76.38,28.19 | v80.95,20.45 79.86,20.45 IC3.21
  Bottom 0.127: v70.98,28.77 70.98,30.03 71.68,30.73 73.58,30.73 74.09,30.23 74.47,30.23 v74.6,30.1 | v76.38,28.19 76.38,27.81 76.25,27.69 76.25,27.05 78.41,24.89 78.41,24.13 79.43,23.11 79.43,21.97 79.55,21.84 80.19,21.84 80.31,21.97 80.95,21.97 81.2,21.72 81.2,20.7 v80.95,20.45
D+  (2 unrouted)
D-  (1 unrouted)
DQ0  (via drill 0.25)
  Top 0.127: U$3.M14 72.28,29.42 72.28,32.6 v72.57,32.89 | 79.89,35.56 IC3.2 79.77,35.56 v78.92,35.56
  Bottom 0.127: v72.57,32.89 73.08,32.89 73.71,32.26 77.77,32.26 78.41,32.89 78.41,35.05 v78.92,35.56
DQ1  (via drill 0.25)
  Top 0.127: U$3.L14 71.63,29.42 v71.63,32.21 | v78.92,34.04 79.81,34.04 IC3.4
  Bottom 0.127: v71.63,32.21 71.81,32.38 72.31,32.38 72.69,32 77.9,32 78.66,32.77 78.66,33.78 v78.92,34.04
DQ2  (via drill 0.25)
  Top 0.127: U$3.B12 65.13,28.12 64.15,28.12 64.08,28.19 62.92,28.19 62.66,28.45 v62.66,28.58 | IC3.5 78.86,33.22 78.66,33.02 78.66,32.13 v78.54,32
  Bottom 0.127: v78.54,32 78.28,31.75 63.8,31.75 62.66,30.61 v62.66,28.58
DQ3  (via drill 0.25)
  Top 0.127: U$3.C12 v65.78,28.12 | IC3.7 78.79,31.62 78.66,31.5 77.52,31.5 v77.14,31.11
  Bottom 0.127: v77.14,31.11 76.76,31.11 76.63,31.24 70.41,31.24 69.9,30.73 69.52,30.73 68.76,31.5 63.93,31.5 62.92,30.48 62.92,29.08 63.17,28.83 63.17,28.45 63.49,28.12 v65.78,28.12
DQ4  (via drill 0.25)
  Top 0.127: U$3.R8 74.67,25.2 v74.85,25.02 | v78.92,30.73 79.74,30.73 IC3.8
  Bottom 0.127: v78.92,30.73 78.66,30.73 78.41,30.99 78.03,30.99 77.39,30.35 76.76,30.35 76.38,30.73 75.74,30.73 75.49,30.48 75.49,25.27 75.23,25.02 v74.85,25.02
DQ5  (via drill 0.25)
  Top 0.127: U$3.P8 73.58,25.52 75.87,25.52 v76,25.4 | v78.92,29.34 79.04,29.21 79.82,29.21 IC3.10
  Bottom 0.127: v76,25.4 76.5,25.4 76.63,25.53 76.63,25.91 75.74,26.8 75.74,30.35 75.87,30.48 76.25,30.48 76.63,30.1 78.66,30.1 78.92,29.84 v78.92,29.34
DQ6
  Top 0.127: U$3.P9 73.58,26.17 76.49,26.17 76.76,25.91 76.76,25.4 77.01,25.15 77.65,25.15 77.9,24.89 77.9,23.49 78.03,23.37 78.54,23.37 78.79,23.62 78.79,25.27 78.28,25.78 78.28,26.54 78.92,27.18 78.92,28.32 79.04,28.45 79.8,28.45 IC3.11
DQ7
  Top 0.127: U$3.R9 76.31,25.85 76.5,25.65 76.5,25.27 76.89,24.89 77.39,24.89 77.65,24.64 77.65,23.37 77.9,23.11 78.66,23.11 79.04,23.49 79.04,25.4 78.54,25.91 78.54,26.42 78.92,26.8 79.81,26.8 IC3.13
DQ8  (via drill 0.25)
  Top 0.127: U$3.P10 73.58,26.83 76.91,26.83 77.39,27.3 v77.9,27.3 | IC3.42 90.07,26.82 v89.69,26.44
  Bottom 0.127: v77.9,27.3 78.03,27.18 78.03,26.67 78.79,25.91 89.16,25.91 v89.69,26.44
DQ9  (via drill 0.25)
  Top 0.127: U$3.R10 77.44,26.5 v77.77,26.16 | v90.6,28.45 91.66,28.45 IC3.44
  Bottom 0.127: v77.77,26.16 77.77,25.91 78.03,25.65 89.71,25.65 90.22,26.16 90.22,28.07 v90.6,28.45
DQ10  (via drill 0.25)
  Top 0.127: U$3.N11 v72.93,27.47 | v92.51,28.45 92.51,28.96 92.25,29.21 IC3.45
  Bottom 0.127: v72.93,27.47 72.99,27.47 73.33,27.81 75.11,27.81 75.23,27.69 75.23,25.78 74.98,25.53 74.6,25.53 74.35,25.27 74.35,24.26 74.47,24.13 76.12,24.13 76.89,24.89 77.65,24.89 77.9,24.64 77.9,23.88 78.92,22.86 78.92,21.72 79.3,21.34 79.3,20.32 79.68,19.94 81.2,19.94 81.46,20.19 81.46,21.21 81.71,21.46 90.35,21.46 90.6,21.72 92.25,21.72 92.51,21.97 v92.51,28.45
DQ11  (via drill 0.25)
  Top 0.127: U$3.P11 73.58,27.47 76.67,27.47 76.89,27.69 76.89,28.19 77.14,28.45 v77.27,28.45 | IC3.47 90.43,30.82 v90.09,30.48
  Bottom 0.127: v90.09,30.48 90.09,30.23 90.35,29.97 90.35,29.34 89.71,28.7 89.71,27.3 89.59,27.18 89.33,27.18 88.95,26.8 88.95,26.54 88.82,26.42 79.04,26.42 78.66,26.8 78.66,27.94 78.28,28.32 77.39,28.32 v77.27,28.45
DQ12  (via drill 0.25)
  Top 0.127: U$3.R11 76.86,27.15 77.39,27.69 v77.39,27.81 | v90.86,31.62 IC3.48
  Bottom 0.127: v77.39,27.81 77.65,28.07 78.16,28.07 78.41,27.81 78.41,26.67 78.92,26.16 88.95,26.16 89.2,26.42 89.2,26.67 89.46,26.92 89.71,26.92 89.97,27.18 89.97,28.58 90.6,29.21 90.6,31.37 v90.86,31.62
DQ13  (via drill 0.25)
  Top 0.127: U$3.P15 73.25,31.93 74.09,32.77 v74.47,32.77 | v89.84,33.15 91.62,33.15 IC3.50
  Bottom 0.127: v74.47,32.77 74.73,32.77 74.98,32.51 77.65,32.51 78.16,33.02 78.16,35.56 78.66,36.07 82.47,36.07 83.49,35.05 83.49,33.66 84,33.15 v89.84,33.15
DQ14  (via drill 0.25)
  Top 0.127: U$3.P14 73.58,29.42 73.58,30.98 73.84,31.24 74.47,31.24 74.73,30.99 75.49,30.99 76,30.48 76,29.84 76.38,29.46 v76.63,29.46 | v90.86,34.04 91.67,34.04 IC3.51
  Bottom 0.127: v76.63,29.46 76.76,29.46 77.27,28.96 77.39,28.96 77.77,28.58 78.41,28.58 78.92,28.07 78.92,26.92 79.17,26.67 88.44,26.67 89.46,27.69 89.46,28.83 90.09,29.46 90.09,29.84 89.59,30.35 89.59,30.73 90.35,31.5 90.35,33.53 v90.86,34.04
DQ15  (via drill 0.25)
  Top 0.127: U$3.N15 72.6,32.17 73.46,33.02 73.84,33.02 74.09,33.27 74.98,33.27 v75.23,33.02 | v90.86,35.56 91.63,35.56 IC3.53
  Bottom 0.127: v75.23,33.02 75.62,33.02 75.87,32.77 77.52,32.77 77.9,33.15 77.9,35.69 78.54,36.32 82.6,36.32 83.74,35.18 83.74,33.78 84.12,33.4 89.33,33.4 89.59,33.66 89.97,33.66 90.35,34.04 90.35,35.05 v90.86,35.56
GND  (via drill 0.1, 0.25)  (63 unrouted)
  other vias: 48.23,9.27 44.98,9.92 44.98,9.27 43.68,6.02 17.37,9.55 18.08,7.52 17.07,7.52 16.05,7.52 16.05,6.5 17.07,6.5 18.08,6.5 18.08,5.49 17.07,5.49 16.05,5.49
  pour Bottom (rank 6, no thermals): 0.41,0.41 0.41,39.62 56.69,39.62 56.69,0.41
  pour Top (rank 6, no thermals): 0.41,0.41 0.41,39.62 56.69,39.62 56.69,0.41
  pour Route2 (no thermals): 0.41,0.41 0.41,39.62 56.69,39.62 56.69,0.41
N$3  (2 unrouted)
N$4  (2 unrouted)
N$24  (via drill 0.25)
  Top 0.305: IC2.5 13.86,6.25 v13.82,6.3
  Bottom 0.305: R1.P$1 v13.82,6.3
N$30
  Top 0.305: IC2.12 16.82,2.86 C4.P$1 C3.1
N$31
  Top 0.305: IC2.17 20.91,4.75 C2.P$1 C1.1
N$50  (via drill 0.1)
  other vias: 50.83,4.72
N$51  (via drill 0.1)
  other vias: 51.48,4.72
N$52  (via drill 0.1)
  other vias: 52.13,4.72
N$53  (via drill 0.1)
  other vias: 48.88,4.72
N$54  (via drill 0.1)
  other vias: 48.23,4.72
N$55  (via drill 0.1)
  other vias: 47.58,4.72
N$56  (via drill 0.1)
  other vias: 46.93,4.72
N$57  (via drill 0.1)
  other vias: 46.28,4.72
N$58  (via drill 0.1)
  other vias: 45.63,4.72
N$69  (via drill 0.25)
  other vias: 45.63,11.88
N$89  (via drill 0.1)
  other vias: 52.78,4.72
NBL0  (via drill 0.25)
  Top 0.127: U$3.A4 64.15,22.6 64.15,22.61 63.55,22.61 63.17,22.22 v63.17,20.95 | IC3.15 80.75,25.22 81.2,24.77 81.2,24.38 81.84,23.75 81.84,23.24 82.09,22.99 83.24,22.99 83.49,22.73 v83.49,22.48
  Route2 0.127: v63.17,20.95 63.3,20.95 63.68,20.57 63.68,19.56 64.57,18.67 67.74,18.67 68.5,17.91 69.77,17.91 70.28,18.41 81.71,18.41 83.24,19.94 83.24,22.22 v83.49,22.48
NBL1  (via drill 0.25)
  Top 0.127: U$3.A3 64.15,21.95 63.8,21.6 v63.8,21.34 | v90.6,24.38 91.65,24.38 IC3.39
  Route2 0.127: v63.8,21.34 63.8,20.95 63.93,20.83 63.93,19.69 64.69,18.92 67.87,18.92 68.63,18.16 69.65,18.16 70.15,18.67 81.58,18.67 82.98,20.07 82.98,22.99 84.38,24.38 v90.6,24.38
OTG_CK  (1 unrouted)
  Top 0.127: U$3.P4 73.58,22.27 74.55,22.27
OTG_D0  (1 unrouted)
  Top 0.127: U$3.R2 74.55,21.3
OTG_D1  (1 unrouted)
  Top 0.127: U$3.R5 74.43,23.25
OTG_D2  (1 unrouted)
OTG_D3  (1 unrouted)
  Top 0.127: U$3.R12 74.55,27.8
OTG_D4  (1 unrouted)
  Top 0.127: U$3.R13 74.55,28.45
OTG_D5  (1 unrouted)
  Top 0.127: U$3.P12 73.58,28.12 74.55,28.12
OTG_D6  (1 unrouted)
OTG_D7  (1 unrouted)
  Top 0.127: U$3.A6 64.15,23.9
OTG_DIR  (1 unrouted)
OTG_NXT  (via drill 0.25)  (1 unrouted)
  Top 0.127: U$3.M5 v72.28,22.92
OTG_STP  (1 unrouted)
  Top 0.127: U$3.M2 72.28,20.97 72.28,20
SDCKE1  (via drill 0.25)
  Top 0.127: U$3.N12 v72.93,28.12 | IC3.37 91.6,22.73 83.87,22.73 82.6,24 82.6,30.99 82.35,31.24 v82.09,31.24
  Bottom 0.127: v72.93,28.12 75.04,28.12 75.23,28.32 75.23,30.61 75.62,30.99 76.5,30.99 76.89,30.61 77.27,30.61 77.9,31.24 v82.09,31.24
SDCLK  (via drill 0.25)
  Top 0.127: U$3.H14 69.68,29.42 v69.68,31.27 | IC3.38 90.6,23.62 89.97,22.99 84,22.99 82.85,24.13 82.85,31.24 82.35,31.75 v81.58,31.75
  Bottom 0.127: v69.68,31.27 69.9,31.5 81.33,31.5 v81.58,31.75
SDNCAS  (via drill 0.25)
  Top 0.127: U$3.B7 65.13,24.88 64.15,24.88 63.66,24.38 v63.55,24.38 | IC3.17 81.21,23.62 v81.33,23.49
  Route2 0.127: v63.55,24.38 63.55,22.61 64.25,21.91 64.25,19.75 64.82,19.18 81.2,19.18 82.47,20.45 82.47,22.35 v81.33,23.49
SDNE1  (via drill 0.25)
  Top 0.127: U$3.M11 v72.28,27.47 | IC3.19 78.84,22.02 78.28,21.46 76.25,21.46 76.12,21.59 76.12,22.22 75.87,22.48 75.23,22.48 v75.11,22.61
  Bottom 0.127: v72.28,27.47 72.82,26.92 72.82,25.27 72.57,25.02 72.06,25.02 71.81,24.77 71.81,22.61 72.06,22.35 72.44,22.35 72.95,22.86 74.98,22.86 75.11,22.73 v75.11,22.61
SDNRAS
  Top 0.127: 79.81,22.8 IC3.18 79.74,22.73 79.17,22.73 78.41,21.97 78.28,21.97 78.16,22.1 78.16,22.22 78.41,22.48 78.41,22.8 78.35,22.86 78.03,22.86 77.9,22.73 77.9,22.48 77.84,22.41 77.52,22.41 77.39,22.54 77.39,22.99 77.14,23.24 77.01,23.24 76.5,22.73 76.38,22.73 76.12,22.99 76.12,23.11 76.5,23.49 76.5,23.62 76.23,23.9 75.89,23.9 75.49,23.49 75.23,23.49 74.83,23.9 U$3.R6
SDNWE  (via drill 0.25)
  Top 0.127: IC3.16 80.66,24.42 v80.7,24.38 | U$3.J4 v69.68,22.27
  Route2 0.127: v69.01,18.67 69.77,18.67 70.03,18.92 81.46,18.92 82.73,20.19 82.73,22.48 81.84,23.37 81.84,23.75 81.2,24.38 v80.7,24.38
  Bottom 0.127: v69.68,22.27 69.03,21.62 69.03,18.69 v69.01,18.67
SPI3_MISO  (1 unrouted)
  Top 0.127: U$3.B13 65.13,28.77 64.15,28.77
SPI3_MOSI  (1 unrouted)
  Top 0.127: U$3.A12 64.15,27.8
SPI3_SCK  (1 unrouted)
  Top 0.127: U$3.B14 65.13,29.42 64.15,29.42
USB_DM  (1 unrouted)
USB_DP  (1 unrouted)
USB_ID  (1 unrouted)
VBUS  (1 unrouted)
  Top 0.127: U$3.E15 67.4,30.4
VDD  (via drill 0.25, 0.33)  (31 unrouted)
  Top 0.127: U$3.G13 v68.38,28.12 | U$3.H13 v69.03,28.12 | U$3.J13 v69.68,28.12 | U$3.N8 v72.28,25.52 | U$3.N9 v72.28,26.17 | U$3.N10 v72.28,26.83 | U$3.J12 v70.33,28.12 | U$3.G3 v69.03,22.27 | U$3.F3 v68.38,22.27 | U$3.K4 v70.33,22.27 | U$3.C5 v66.43,23.58 | U$3.C7 v66.43,24.88 | U$3.C8 v66.43,25.52 | U$3.C9 v66.43,26.17 | U$3.R1 v74.23,20.33 | U$3.C1 v66.43,20.33
  Top 0.305: R10.P$2 v11.38,4.47
  Bottom 0.127: C12.1 v68.38,28.12 | C13.1 v69.03,28.12 | C14.1 v69.68,28.12 | C19.1 v72.28,25.52 | C10.1 v72.28,26.17 | C11.1 v72.28,26.83 | C20.1 v70.33,28.12 | C24.1 v68.38,22.27 | C23.1 v69.03,22.27 | C22.1 v70.33,22.27 | C21.1 v66.43,26.17 | C25.1 v66.43,25.52 | C18.1 v66.43,24.88 | C17.1 v66.43,23.58 | C15.1 73.9,20 v74.23,20.33 | C16.1 66.1,20 v66.43,20.33
  pour Route3: 0.41,0.41 0.41,39.62 56.69,39.62 56.69,0.41

### Text on the board
tPlace: AHI | AHI | GND | M1